# EAGLE board BT60-Test-jig (EAGLE 9.6.2), part 1 of 2
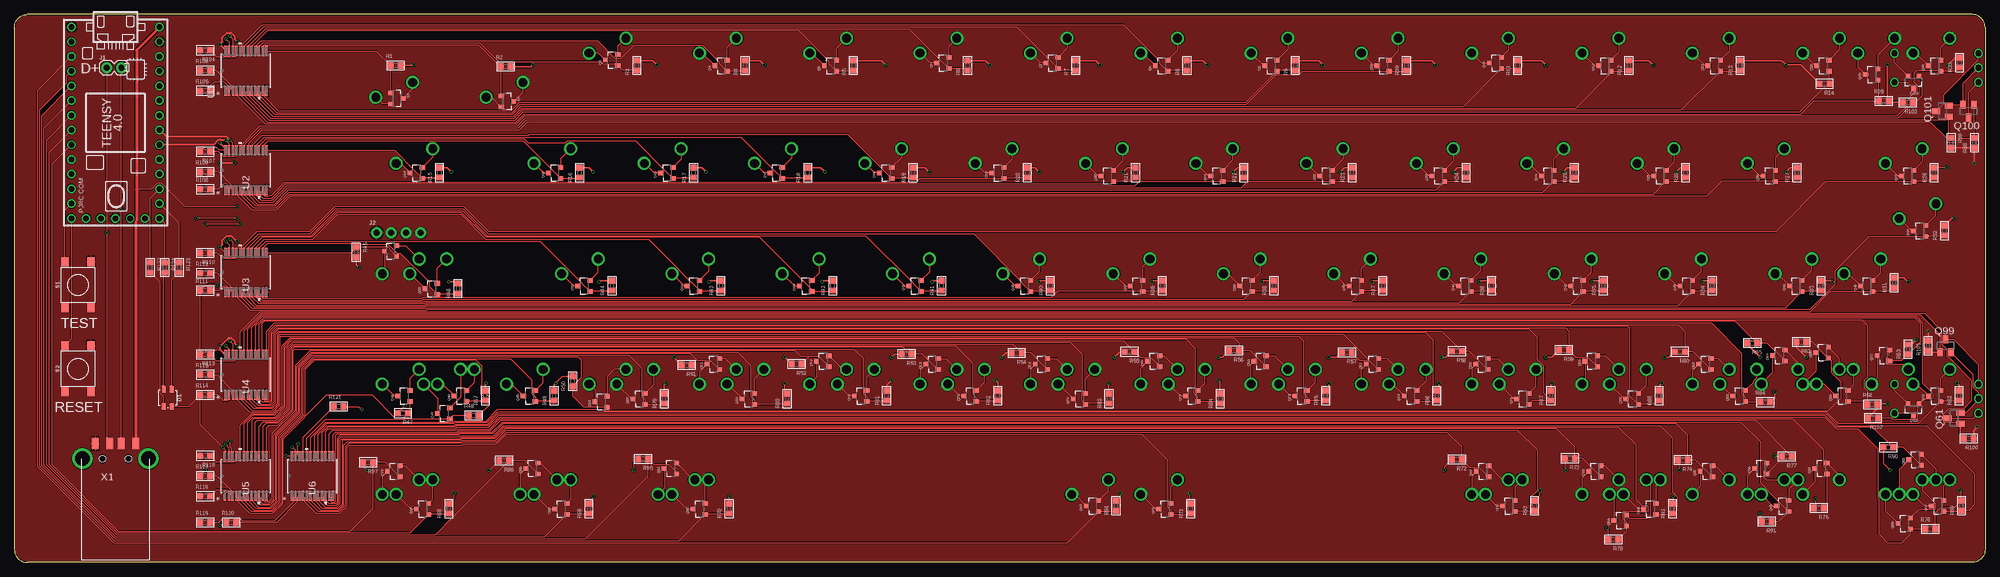
[diagram p2: board, top side]
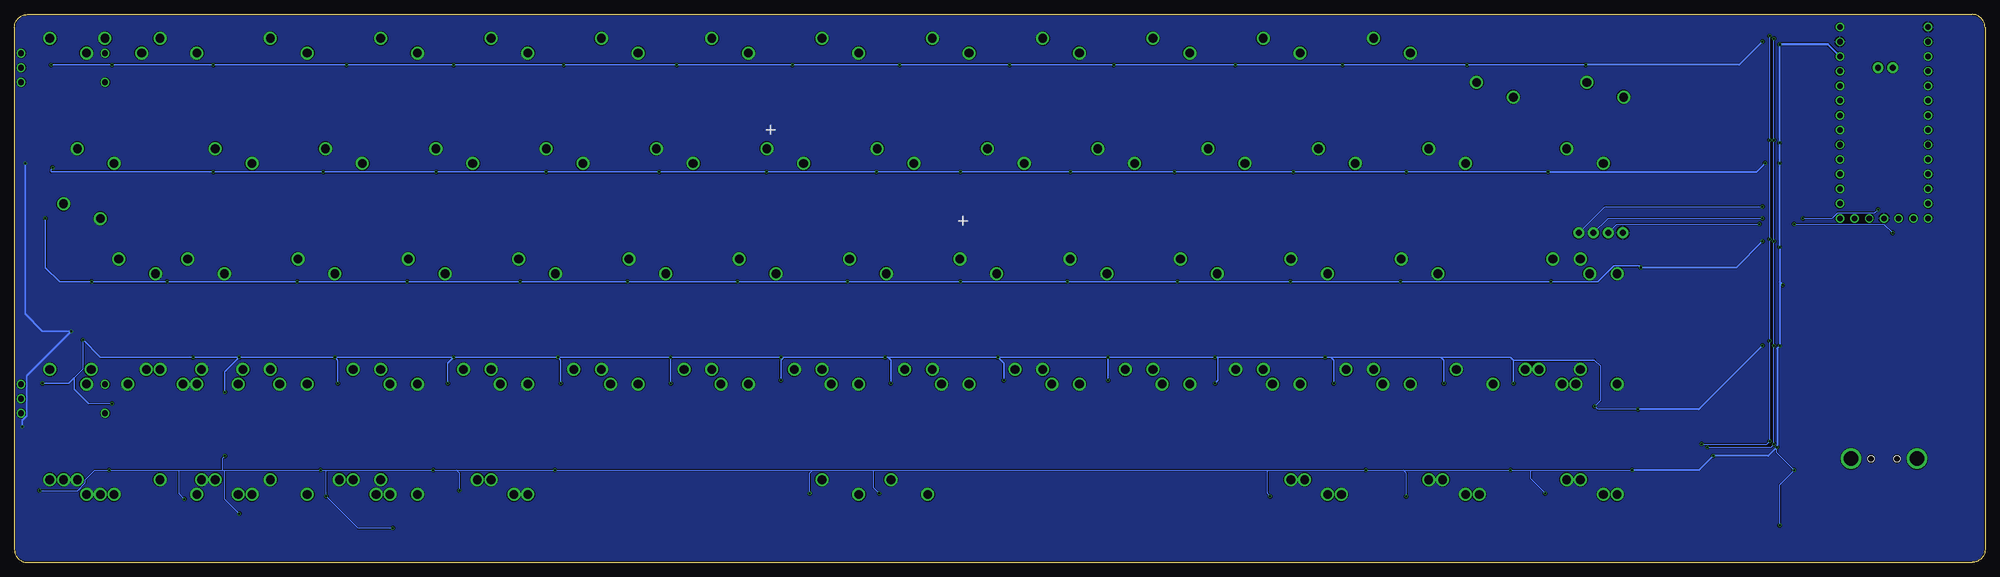
[diagram p3: board, bottom side, seen from below]

Size 340.28 x 94.59 mm. Coordinates in mm from the lower left corner, seen from the top.
Outline: 338.07,94.59 2.21,94.59 arc90 0,92.38 0,2.21 arc90 2.21,0 338.07,0 arc90 340.28,2.21 340.28,92.38 arc90 338.07,94.59
Copper layers (1*16): Top 0.035559375mm / dielectric 1.6mm / Bottom 0.035559375mm
Design rules "jlcpcb2layer": minimum track width 5mil, minimum drill 12mil, track to track 5mil, track to pad 5mil, pad to pad 5mil, via to via 5mil, smd to smd 5mil, copper to edge 8mil, drill to drill 6mil, minimum pad ring 5mil, minimum via ring 3mil, stop-mask expansion 2.5mil, vias tented up to drill 0mil, thermal gap 10mil

## Footprints (pad centres in the part's own frame; a part is rotated, then mirrored left to right if it is on the bottom)
CHERRY-TEST = drill 1.499: P$1 -3.81,2.54; P$2 2.54,5.08
LED-TRICOLOR-SMD = smd 1.2 x 0.7: A 1.5,0.7; B -1.5,0.7; G -1.5,-0.7; R 1.5,-0.7
1X02 = drill 1.016 pad 1.88: 1 0,0; 2 2.54,0
1X04_NO_SILK = drill 1.016 pad 1.88: 1 0,0; 2 2.54,0; 3 5.08,0; 4 7.62,0
SOT23-3 = smd 0.8 x 0.9: 1 -0.95,-1; 2 0.95,-1; 3 0,1.1
SOT23 = smd 1 x 1.4: 1 -0.95,-1.1; 2 0.95,-1.1; 3 0,1.1
0603-R = smd 1 x 1.1: 1 -0.85,0; 2 0.85,0
TACTILE_SWITCH_SMD_6.2MM_TALL = smd 1.55 x 1.3: A1 -3.975,-2.25; A2 3.975,-2.25; B1 -3.975,2.25; B2 3.975,2.25
SOT340-1_NXP = smd 1.753 x 0.432: 1 -3.429,3.575; 2 -3.429,2.925; 3 -3.429,2.275; 4 -3.429,1.625; 5 -3.429,0.975; 6 -3.429,0.325; 7 -3.429,-0.325; 8 -3.429,-0.975; 9 -3.429,-1.625; 10 -3.429,-2.275; 11 -3.429,-2.925; 12 -3.429,-3.575; 13 3.429,-3.575; 14 3.429,-2.925; 15 3.429,-2.275; 16 3.429,-1.625; 17 3.429,-0.975; 18 3.429,-0.325; 19 3.429,0.325; 20 3.429,0.975; 21 3.429,1.625; 22 3.429,2.275; 23 3.429,2.925; 24 3.429,3.575
ENCODER = drill 0.991: A -2.5,-7.5; B 2.5,-7.5; GND 0,-7.5; S1 -2.5,7; S2 2.5,7
TEENSY_4.0 = drill 0.965: 0/RX -13.97,-7.62; 1/TX -11.43,-7.62; 2 -8.89,-7.62; 3/CANTX -6.35,-7.62; 3V3_LN 16.51,-2.54; 3V3_LO -11.43,7.62; 4/CANRX -3.81,-7.62; 5 -1.27,-7.62; 6 1.27,-7.62; 7 3.81,-7.62; 8 6.35,-7.62; 9/CS 8.89,-7.62; 10/CS 11.43,-7.62; 11/MOSI 13.97,-7.62; 12/MISO 16.51,-7.62; 13/SCK 16.51,7.62; 14/A0 13.97,7.62; 15/A1 11.43,7.62; 16/A2 8.89,7.62; 17/A3 6.35,7.62; 18/A4/SDA 3.81,7.62; 19/A5/SCL 1.27,7.62; 20/A6 -1.27,7.62; 21/A7 -3.81,7.62; 22/A8 -6.35,7.62; 23/A9 -8.89,7.62; GND -16.51,-7.62; GND2 -13.97,7.62; GND3 16.51,0; ON/OFF 16.51,5.08; PROG 16.51,2.54; VBAT\ 16.51,-5.08; VIN -16.51,7.62
MOLEX_480371000 = smd 1.2 x 2: 1 3.5,2.6; 2 1,2.6; 3 -1,2.6; 4 -3.5,2.6 | drill 2.5: M1 -5.7,0; M2 5.7,0 | hole 1.1: -2.25,0; 2.25,0

## Placement (x,y rotation side)
0  CHERRY-SOLDERCHERRY-TEST  [CHERRY-TEST]  255.45,85.39 0 top
1  CHERRY-SOLDERCHERRY-TEST  [CHERRY-TEST]  84,85.39 180 top
1U_1  CHERRY-SOLDERCHERRY-TEST  [CHERRY-TEST]  255.45,9.19 0 top
1U_2  CHERRY-SOLDERCHERRY-TEST  [CHERRY-TEST]  274.5,9.19 0 top
1U_3  CHERRY-SOLDERCHERRY-TEST  [CHERRY-TEST]  293.55,9.19 0 top
1U_4  CHERRY-SOLDERCHERRY-TEST  [CHERRY-TEST]  312.6,9.19 0 top
1U_5  CHERRY-SOLDERCHERRY-TEST  [CHERRY-TEST]  331.65,9.19 0 top
2  CHERRY-SOLDERCHERRY-TEST  [CHERRY-TEST]  103.05,85.39 0 top
3  CHERRY-SOLDERCHERRY-TEST  [CHERRY-TEST]  122.1,85.39 0 top
4  CHERRY-SOLDERCHERRY-TEST  [CHERRY-TEST]  141.15,85.39 0 top
5  CHERRY-SOLDERCHERRY-TEST  [CHERRY-TEST]  160.2,85.39 0 top
6  CHERRY-SOLDERCHERRY-TEST  [CHERRY-TEST]  179.25,85.39 0 top
7  CHERRY-SOLDERCHERRY-TEST  [CHERRY-TEST]  198.3,85.39 0 top
8  CHERRY-SOLDERCHERRY-TEST  [CHERRY-TEST]  217.35,85.39 0 top
9  CHERRY-SOLDERCHERRY-TEST  [CHERRY-TEST]  236.4,85.39 0 top
#_ISO  CHERRY-SOLDERCHERRY-TEST  [CHERRY-TEST]  88.76,28.24 0 top
'  CHERRY-SOLDERCHERRY-TEST  [CHERRY-TEST]  288.78,47.29 0 top
,  CHERRY-SOLDERCHERRY-TEST  [CHERRY-TEST]  241.16,28.24 0 top
,_1  CHERRY-SOLDERCHERRY-TEST  [CHERRY-TEST]  236.4,28.24 0 top
-  CHERRY-SOLDERCHERRY-TEST  [CHERRY-TEST]  274.5,85.39 0 top
.  CHERRY-SOLDERCHERRY-TEST  [CHERRY-TEST]  260.21,28.24 0 top
._1  CHERRY-SOLDERCHERRY-TEST  [CHERRY-TEST]  255.45,28.24 0 top
/  CHERRY-SOLDERCHERRY-TEST  [CHERRY-TEST]  279.26,28.24 0 top
/_1  CHERRY-SOLDERCHERRY-TEST  [CHERRY-TEST]  274.5,28.24 0 top
=  CHERRY-SOLDERCHERRY-TEST  [CHERRY-TEST]  293.55,85.39 0 top
[  CHERRY-SOLDERCHERRY-TEST  [CHERRY-TEST]  284.02,66.34 0 top
\  CHERRY-SOLDERCHERRY-TEST  [CHERRY-TEST]  326.88,66.34 0 top
]  CHERRY-SOLDERCHERRY-TEST  [CHERRY-TEST]  303.07,66.34 0 top
A  CHERRY-SOLDERCHERRY-TEST  [CHERRY-TEST]  98.28,47.29 0 top
B  CHERRY-SOLDERCHERRY-TEST  [CHERRY-TEST]  184.01,28.24 0 top
B_1  CHERRY-SOLDERCHERRY-TEST  [CHERRY-TEST]  179.25,28.24 0 top
BS  CHERRY-SOLDERCHERRY-TEST  [CHERRY-TEST]  322.12,85.39 0 top
C  CHERRY-SOLDERCHERRY-TEST  [CHERRY-TEST]  145.91,28.24 0 top
C_1  CHERRY-SOLDERCHERRY-TEST  [CHERRY-TEST]  141.15,28.24 0 top
CAPS  CHERRY-SOLDERCHERRY-TEST  [CHERRY-TEST]  72.09,47.29 0 top
CAPS_STEP  CHERRY-SOLDERCHERRY-TEST  [CHERRY-TEST]  67.33,47.29 0 top
COLON  CHERRY-SOLDERCHERRY-TEST  [CHERRY-TEST]  269.73,47.29 0 top
D  CHERRY-SOLDERCHERRY-TEST  [CHERRY-TEST]  136.38,47.29 0 top
D1  [LED-TRICOLOR-SMD]  26.45,28.41 270 top
E  CHERRY-SOLDERCHERRY-TEST  [CHERRY-TEST]  131.62,66.34 0 top
ENTER  CHERRY-SOLDERCHERRY-TEST  [CHERRY-TEST]  319.74,47.29 0 top
ESC  CHERRY-SOLDERCHERRY-TEST  [CHERRY-TEST]  64.95,85.39 180 top
EXTRA_1U_LEFT  CHERRY-SOLDERCHERRY-TEST  [CHERRY-TEST]  298.31,28.24 0 top
F  CHERRY-SOLDERCHERRY-TEST  [CHERRY-TEST]  155.43,47.29 0 top
FN  CHERRY-SOLDERCHERRY-TEST  [CHERRY-TEST]  329.26,9.19 0 top
G  CHERRY-SOLDERCHERRY-TEST  [CHERRY-TEST]  174.48,47.29 0 top
H  CHERRY-SOLDERCHERRY-TEST  [CHERRY-TEST]  193.53,47.29 0 top
I  CHERRY-SOLDERCHERRY-TEST  [CHERRY-TEST]  226.9,66.34 0 top
ISO_#  CHERRY-SOLDERCHERRY-TEST  [CHERRY-TEST]  307.83,47.29 0 top
ISO_ENTER  CHERRY-SOLDERCHERRY-TEST  [CHERRY-TEST]  329.26,56.82 0 top
J  CHERRY-SOLDERCHERRY-TEST  [CHERRY-TEST]  212.58,47.29 0 top
J1  [1X02]  15.95,85.41 0 top
J2  [1X04_NO_SILK]  62.53,56.88 0 top
K  CHERRY-SOLDERCHERRY-TEST  [CHERRY-TEST]  231.63,47.29 0 top
L  CHERRY-SOLDERCHERRY-TEST  [CHERRY-TEST]  250.68,47.29 0 top
L_1.25U_SHIFT  CHERRY-SOLDERCHERRY-TEST  [CHERRY-TEST]  67.33,28.24 0 top
L_2U_SHIFT  CHERRY-SOLDERCHERRY-TEST  [CHERRY-TEST]  74.47,28.24 0 top
L_SHIFT  CHERRY-SOLDERCHERRY-TEST  [CHERRY-TEST]  76.85,28.24 0 top
LALT  CHERRY-SOLDERCHERRY-TEST  [CHERRY-TEST]  114.95,9.19 0 top
LALT_1.5U  CHERRY-SOLDERCHERRY-TEST  [CHERRY-TEST]  117.33,9.19 0 top
LCTRL  CHERRY-SOLDERCHERRY-TEST  [CHERRY-TEST]  67.33,9.19 0 top
LCTRL_1.5U  CHERRY-SOLDERCHERRY-TEST  [CHERRY-TEST]  69.71,9.19 0 top
LWIN  CHERRY-SOLDERCHERRY-TEST  [CHERRY-TEST]  91.14,9.19 0 top
LWIN_1U  CHERRY-SOLDERCHERRY-TEST  [CHERRY-TEST]  93.52,9.19 0 top
M  CHERRY-SOLDERCHERRY-TEST  [CHERRY-TEST]  222.11,28.24 0 top
M_1  CHERRY-SOLDERCHERRY-TEST  [CHERRY-TEST]  217.35,28.24 0 top
MENU  CHERRY-SOLDERCHERRY-TEST  [CHERRY-TEST]  281.64,9.19 0 top
MENU_1U  CHERRY-SOLDERCHERRY-TEST  [CHERRY-TEST]  303.07,9.19 0 top
N  CHERRY-SOLDERCHERRY-TEST  [CHERRY-TEST]  203.06,28.24 0 top
N_1  CHERRY-SOLDERCHERRY-TEST  [CHERRY-TEST]  198.3,28.24 0 top
O  CHERRY-SOLDERCHERRY-TEST  [CHERRY-TEST]  245.92,66.34 0 top
P  CHERRY-SOLDERCHERRY-TEST  [CHERRY-TEST]  264.97,66.34 0 top
Q  CHERRY-SOLDERCHERRY-TEST  [CHERRY-TEST]  93.52,66.34 0 top
Q1  MOSFET-PCHANNEL  [SOT23-3]  66.01,80.1 270 top
Q2  MOSFET-PCHANNEL  [SOT23-3]  85.08,79.56 270 top
Q3  MOSFET-PCHANNEL  [SOT23-3]  103.2,86.73 90 top
Q4  MOSFET-PCHANNEL  [SOT23-3]  122.08,85.73 90 top
Q5  MOSFET-PCHANNEL  [SOT23-3]  140.97,85.73 90 top
Q6  MOSFET-PCHANNEL  [SOT23-3]  160.36,86.23 90 top
Q7  MOSFET-PCHANNEL  [SOT23-3]  179.24,86.23 90 top
Q8  MOSFET-PCHANNEL  [SOT23-3]  198.13,85.73 90 top
Q9  MOSFET-PCHANNEL  [SOT23-3]  217.02,85.73 90 top
Q10  MOSFET-PCHANNEL  [SOT23-3]  236.4,85.73 90 top
Q11  MOSFET-PCHANNEL  [SOT23-3]  255.79,86.23 90 top
Q12  MOSFET-PCHANNEL  [SOT23-3]  274.67,85.73 90 top
Q13  MOSFET-PCHANNEL  [SOT23-3]  293.56,85.73 90 top
Q14  MOSFET-PCHANNEL  [SOT23-3]  69.45,67.23 90 top
Q15  MOSFET-PCHANNEL  [SOT23-3]  93.33,67.23 90 top
Q16  MOSFET-PCHANNEL  [SOT23-3]  112.72,67.23 90 top
Q17  MOSFET-PCHANNEL  [SOT23-3]  131.6,67.23 90 top
Q18  MOSFET-PCHANNEL  [SOT23-3]  150.49,67.23 90 top
Q19  MOSFET-PCHANNEL  [SOT23-3]  169.88,67.23 90 top
Q20  MOSFET-PCHANNEL  [SOT23-3]  188.76,66.73 90 top
Q21  MOSFET-PCHANNEL  [SOT23-3]  207.65,66.73 90 top
Q22  MOSFET-PCHANNEL  [SOT23-3]  226.54,66.73 90 top
Q23  MOSFET-PCHANNEL  [SOT23-3]  245.92,66.73 90 top
Q24  MOSFET-PCHANNEL  [SOT23-3]  264.81,66.73 90 top
Q25  MOSFET-PCHANNEL  [SOT23-3]  284.19,66.73 90 top
Q26  MOSFET-PCHANNEL  [SOT23-3]  303.08,66.73 90 top
Q27  MOSFET-PCHANNEL  [SOT23-3]  326.97,66.73 90 top
Q28  MOSFET-PCHANNEL  [SOT23-3]  312.35,85.73 90 top
Q29  MOSFET-PCHANNEL  [SOT23-3]  320.74,84.23 90 top
Q30  MOSFET-PCHANNEL  [SOT23-3]  331.63,85.73 90 top
Q31  MOSFET-PCHANNEL  [SOT23-3]  65.01,53.73 90 top
Q32  MOSFET-PCHANNEL  [SOT23-3]  98.4,47.73 90 top
Q33  MOSFET-PCHANNEL  [SOT23-3]  117.28,47.73 90 top
Q34  MOSFET-PCHANNEL  [SOT23-3]  136.67,47.73 90 top
Q35  MOSFET-PCHANNEL  [SOT23-3]  155.56,47.73 90 top
Q36  MOSFET-PCHANNEL  [SOT23-3]  174.44,47.73 90 top
Q37  MOSFET-PCHANNEL  [SOT23-3]  193.83,47.73 90 top
Q38  MOSFET-PCHANNEL  [SOT23-3]  212.72,47.73 90 top
Q39  MOSFET-PCHANNEL  [SOT23-3]  231.6,47.73 90 top
Q40  MOSFET-PCHANNEL  [SOT23-3]  250.49,47.73 90 top
Q41  MOSFET-PCHANNEL  [SOT23-3]  269.87,47.73 90 top
Q42  MOSFET-PCHANNEL  [SOT23-3]  288.76,47.73 90 top
Q43  MOSFET-PCHANNEL  [SOT23-3]  307.65,47.73 90 top
Q44  MOSFET-PCHANNEL  [SOT23-3]  329.03,57.23 90 top
Q45  MOSFET-PCHANNEL  [SOT23-3]  319.92,47.73 90 top
Q46  MOSFET-PCHANNEL  [SOT23-3]  67.3,28.73 90 top
Q47  MOSFET-PCHANNEL  [SOT23-3]  74.19,25.73 90 top
Q48  MOSFET-PCHANNEL  [SOT23-3]  77.08,28.73 90 top
Q49  MOSFET-PCHANNEL  [SOT23-3]  88.96,28.73 90 top
Q50  MOSFET-PCHANNEL  [SOT23-3]  101.35,27.73 90 top
Q51  MOSFET-PCHANNEL  [SOT23-3]  120.74,34.23 90 top
Q52  MOSFET-PCHANNEL  [SOT23-3]  139.62,34.73 90 top
Q53  MOSFET-PCHANNEL  [SOT23-3]  158.51,34.23 90 top
Q54  MOSFET-PCHANNEL  [SOT23-3]  177.39,34.23 90 top
Q55  MOSFET-PCHANNEL  [SOT23-3]  196.78,34.73 90 top
Q56  MOSFET-PCHANNEL  [SOT23-3]  215.17,34.73 90 top
Q57  MOSFET-PCHANNEL  [SOT23-3]  234.55,34.23 90 top
Q58  MOSFET-PCHANNEL  [SOT23-3]  253.44,34.23 90 top
Q59  MOSFET-PCHANNEL  [SOT23-3]  272.33,34.73 90 top
Q60  MOSFET-PCHANNEL  [SOT23-3]  312.21,36.23 90 top
Q61  [SOT23]  334.95,24.91 90 top
Q62  MOSFET-PCHANNEL  [SOT23-3]  291.98,34.23 90 top
Q63  MOSFET-PCHANNEL  [SOT23-3]  297.87,28.73 90 top
Q64  MOSFET-PCHANNEL  [SOT23-3]  304.76,35.73 90 top
Q65  MOSFET-PCHANNEL  [SOT23-3]  315.64,28.73 90 top
Q66  MOSFET-PCHANNEL  [SOT23-3]  72.03,47.23 90 top
Q67  MOSFET-PCHANNEL  [SOT23-3]  107.91,28.23 90 top
Q68  MOSFET-PCHANNEL  [SOT23-3]  126.8,28.23 90 top
Q69  MOSFET-PCHANNEL  [SOT23-3]  146.19,28.73 90 top
Q70  MOSFET-PCHANNEL  [SOT23-3]  165.07,28.73 90 top
Q71  MOSFET-PCHANNEL  [SOT23-3]  183.96,28.23 90 top
Q72  MOSFET-PCHANNEL  [SOT23-3]  203.35,28.73 90 top
Q73  MOSFET-PCHANNEL  [SOT23-3]  222.23,28.73 90 top
Q74  MOSFET-PCHANNEL  [SOT23-3]  241.12,28.73 90 top
Q75  MOSFET-PCHANNEL  [SOT23-3]  260.5,28.23 90 top
Q76  MOSFET-PCHANNEL  [SOT23-3]  279.39,28.23 90 top
Q77  MOSFET-PCHANNEL  [SOT23-3]  322.78,35.73 90 top
Q78  MOSFET-PCHANNEL  [SOT23-3]  331.66,28.73 90 top
Q79  MOSFET-PCHANNEL  [SOT23-3]  65.55,15.73 90 top
Q80  MOSFET-PCHANNEL  [SOT23-3]  89.44,16.23 90 top
Q81  MOSFET-PCHANNEL  [SOT23-3]  113.32,16.23 90 top
Q82  MOSFET-PCHANNEL  [SOT23-3]  186.21,9.73 90 top
Q83  MOSFET-PCHANNEL  [SOT23-3]  258.09,9.73 90 top
Q84  MOSFET-PCHANNEL  [SOT23-3]  282.48,9.23 90 top
Q85  MOSFET-PCHANNEL  [SOT23-3]  305.37,9.73 90 top
Q86  MOSFET-PCHANNEL  [SOT23-3]  328.25,17.73 90 top
Q87  MOSFET-PCHANNEL  [SOT23-3]  332.14,9.73 90 top
Q88  MOSFET-PCHANNEL  [SOT23-3]  70.53,9.23 90 top
Q89  MOSFET-PCHANNEL  [SOT23-3]  94.41,9.23 90 top
Q90  MOSFET-PCHANNEL  [SOT23-3]  118.3,9.23 90 top
Q91  MOSFET-PCHANNEL  [SOT23-3]  198.68,9.23 90 top
Q92  MOSFET-PCHANNEL  [SOT23-3]  253.57,15.73 90 top
Q93  MOSFET-PCHANNEL  [SOT23-3]  272.96,15.73 90 top
Q94  MOSFET-PCHANNEL  [SOT23-3]  277.34,7.23 90 top
Q95  MOSFET-PCHANNEL  [SOT23-3]  292.23,15.73 90 top
Q96  MOSFET-PCHANNEL  [SOT23-3]  301.61,16.23 90 top
Q97  MOSFET-PCHANNEL  [SOT23-3]  312,16.23 90 top
Q98  MOSFET-PCHANNEL  [SOT23-3]  326.39,6.73 90 top
Q99  [SOT23]  333.45,37.41 0 top
Q100  [SOT23]  337.45,77.91 180 top
Q101  [SOT23]  332.95,77.91 90 top
Q102  MOSFET-PCHANNEL  [SOT23-3]  327.95,26.41 180 top
Q103  MOSFET-PCHANNEL  [SOT23-3]  327.95,82.91 180 top
R  CHERRY-SOLDERCHERRY-TEST  [CHERRY-TEST]  150.67,66.34 0 top
R1  100k  [0603-R]  65.82,85.78 0 top
R2  100k  [0603-R]  84.82,85.58 0 top
R3  100k  [0603-R]  107.47,85.78 90 top
R4  100k  [0603-R]  126.17,85.78 90 top
R5  100k  [0603-R]  144.87,85.78 90 top
R6  100k  [0603-R]  164.57,85.78 90 top
R7  100k  [0603-R]  183.27,85.78 90 top
R8  100k  [0603-R]  202.47,85.78 90 top
R9  100k  [0603-R]  221.17,85.78 90 top
R10  100k  [0603-R]  240.37,85.78 90 top
R11  100k  [0603-R]  259.57,85.78 90 top
R12  100k  [0603-R]  278.77,85.78 90 top
R13  100k  [0603-R]  297.97,85.78 90 top
R14  100k  [0603-R]  312.57,82.64 180 top
R15  100k  [0603-R]  73.38,67.28 90 top
R16  100k  [0603-R]  97.58,67.28 90 top
R17  100k  [0603-R]  117.28,67.28 90 top
R18  100k  [0603-R]  136.98,67.28 90 top
R19  100k  [0603-R]  155.18,67.28 90 top
R20  100k  [0603-R]  174.88,67.28 90 top
R21  100k  [0603-R]  193.58,67.28 90 top
R22  100k  [0603-R]  212.28,67.28 90 top
R23  100k  [0603-R]  230.98,67.28 90 top
R24  100k  [0603-R]  250.68,67.28 90 top
R25  100k  [0603-R]  269.38,67.28 90 top
R26  100k  [0603-R]  288.58,67.28 90 top
R27  100k  [0603-R]  307.78,67.28 90 top
R28  100k  [0603-R]  331.48,67.28 90 top
R29  100k  [0603-R]  322.82,79.67 0 top
R30  100k  [0603-R]  335.88,86.28 90 top
R31  100k  [0603-R]  324.58,48.28 90 top
R32  100k  [0603-R]  333.28,57.28 90 top
R33  100k  [0603-R]  311.98,47.78 90 top
R34  100k  [0603-R]  293.18,47.78 90 top
R35  100k  [0603-R]  274.38,47.78 90 top
R36  100k  [0603-R]  255.08,47.78 90 top
R37  100k  [0603-R]  236.28,47.78 90 top
R38  100k  [0603-R]  217.48,47.78 90 top
R39  100k  [0603-R]  198.19,47.78 90 top
R40  100k  [0603-R]  178.89,47.78 90 top
R41  100k  [0603-R]  160.09,47.78 90 top
R42  100k  [0603-R]  141.29,47.78 90 top
R43  100k  [0603-R]  121.99,47.78 90 top
R44  100k  [0603-R]  103.19,47.78 90 top
R45  100k  [0603-R]  59,53.53 270 top
R46  100k  [0603-R]  76.59,47.28 90 top
R47  100k  [0603-R]  67.07,25.75 180 top
R48  100k  [0603-R]  79.32,25.36 0 top
R49  100k  [0603-R]  93.19,28.78 90 top
R50  100k  [0603-R]  96.39,31.28 90 top
R51  100k  [0603-R]  116.07,34.05 180 top
R52  100k  [0603-R]  135.07,34.25 180 top
R53  100k  [0603-R]  154.07,35.95 180 top
R54  100k  [0603-R]  173.07,36.15 180 top
R55  100k  [0603-R]  192.57,36.35 180 top
R56  100k  [0603-R]  210.57,36.55 180 top
R57  100k  [0603-R]  230.07,36.25 180 top
R58  100k  [0603-R]  249.07,36.45 180 top
R59  100k  [0603-R]  267.57,36.66 180 top
R60  100k  [0603-R]  287.57,36.36 180 top
R61  100k  [0603-R]  308.57,38.06 180 top
R62  100k  [0603-R]  335.79,28.78 90 top
R63  100k  [0603-R]  326.99,36.78 90 top
R64  100k  [0603-R]  302.32,27.66 0 top
R65  100k  [0603-R]  300.07,37.86 180 top
R66  100k  [0603-R]  320.82,27.26 0 top
R67  100k  [0603-R]  81.3,28.78 90 top
R68  100k  [0603-R]  75,9.28 90 top
R69  100k  [0603-R]  99.2,9.28 90 top
R70  100k  [0603-R]  123.4,9.28 90 top
R71  100k  [0603-R]  203.1,9.28 90 top
R72  100k  [0603-R]  249.07,17.76 180 top
R73  100k  [0603-R]  268.57,17.96 180 top
R74  100k  [0603-R]  288.07,17.66 180 top
R75  100k  [0603-R]  311.57,9.36 180 top
R76  100k  [0603-R]  330.82,5.75 0 top
R77  100k  [0603-R]  306.07,18.26 180 top
R78  100k  [0603-R]  276.07,3.96 180 top
R79  100k  [0603-R]  112.2,28.28 90 top
R80  100k  [0603-R]  133.4,28.28 90 top
R81  100k  [0603-R]  150.6,28.78 90 top
R82  100k  [0603-R]  169.8,28.78 90 top
R83  100k  [0603-R]  189,28.28 90 top
R84  100k  [0603-R]  208.2,28.28 90 top
R85  100k  [0603-R]  226.4,28.78 90 top
R86  100k  [0603-R]  245.6,28.78 90 top
R87  100k  [0603-R]  265.3,28.78 90 top
R88  100k  [0603-R]  284,28.78 90 top
R89  100k  [0603-R]  336.21,9.78 90 top
R90  100k  [0603-R]  323.57,19.87 180 top
R91  100k  [0603-R]  302.57,7.07 180 top
R92  100k  [0603-R]  286.31,9.28 90 top
R93  100k  [0603-R]  262.51,9.78 90 top
R94  100k  [0603-R]  190.21,9.78 90 top
R95  100k  [0603-R]  108.57,17.87 180 top
R96  100k  [0603-R]  84.57,17.57 180 top
R97  100k  [0603-R]  61.07,17.27 180 top
R98  100k  [0603-R]  338.45,72.41 90 top
R99  100k  [0603-R]  334.45,72.41 270 top
R100  100k  [0603-R]  337.45,21.41 180 top
R101  100k  [0603-R]  330.45,37.41 90 top
R102  100k  [0603-R]  320.95,24.91 180 top
R103  100k  [0603-R]  326.95,79.41 180 top
R104  100k  [0603-R]  32.95,88.41 180 top
R105  100k  [0603-R]  32.95,81.41 0 top
R106  100k  [0603-R]  32.95,84.91 0 top
R107  100k  [0603-R]  32.95,70.91 180 top
R108  100k  [0603-R]  32.95,64.41 0 top
R109  100k  [0603-R]  32.95,67.41 0 top
R110  100k  [0603-R]  32.95,53.41 180 top
R111  100k  [0603-R]  32.95,46.91 0 top
R112  100k  [0603-R]  32.95,49.91 0 top
R113  100k  [0603-R]  32.95,35.91 180 top
R114  100k  [0603-R]  32.95,28.91 0 top
R115  100k  [0603-R]  32.95,32.41 0 top
R116  100k  [0603-R]  32.95,11.41 0 top
R117  100k  [0603-R]  32.95,14.91 0 top
R118  100k  [0603-R]  32.95,18.41 180 top
R119  100k  [0603-R]  32.95,6.91 0 top
R120  100k  [0603-R]  37.45,6.91 0 top
R121  100k  [0603-R]  55.95,26.91 0 top
R122  200  [0603-R]  23.45,50.91 270 top
R123  200  [0603-R]  28.45,50.91 270 top
R124  200  [0603-R]  25.95,50.91 270 top
R_ALT_1.5  CHERRY-SOLDERCHERRY-TEST  [CHERRY-TEST]  279.26,9.19 0 top
R_CTRL_1.5U  CHERRY-SOLDERCHERRY-TEST  [CHERRY-TEST]  326.88,9.19 0 top
R_SHIFT  CHERRY-SOLDERCHERRY-TEST  [CHERRY-TEST]  314.98,28.24 0 top
R_SHIFT_1.75U_LEFT  CHERRY-SOLDERCHERRY-TEST  [CHERRY-TEST]  305.45,28.24 0 top
R_SHIFT_1.75U_RIGHT  CHERRY-SOLDERCHERRY-TEST  [CHERRY-TEST]  324.5,28.24 0 top
RALT  CHERRY-SOLDERCHERRY-TEST  [CHERRY-TEST]  257.83,9.19 0 top
RCTRL  CHERRY-SOLDERCHERRY-TEST  [CHERRY-TEST]  305.45,9.19 0 top
S  CHERRY-SOLDERCHERRY-TEST  [CHERRY-TEST]  117.33,47.29 0 top
S1  MOMENTARY-SWITCH-SPST-SMD-6.2MM-TALL  [TACTILE_SWITCH_SMD_6.2MM_TALL]  10.95,47.91 90 top
S2  MOMENTARY-SWITCH-SPST-SMD-6.2MM-TALL  [TACTILE_SWITCH_SMD_6.2MM_TALL]  10.95,33.41 90 top
SPACE_6.25U  CHERRY-SOLDERCHERRY-TEST  [CHERRY-TEST]  186.39,9.19 0 top
SPACE_7U  CHERRY-SOLDERCHERRY-TEST  [CHERRY-TEST]  198.3,9.19 0 top
SPLIT_BS_1  CHERRY-SOLDERCHERRY-TEST  [CHERRY-TEST]  312.6,85.39 0 top
SPLIT_BS_2  CHERRY-SOLDERCHERRY-TEST  [CHERRY-TEST]  331.65,85.39 0 top
T  CHERRY-SOLDERCHERRY-TEST  [CHERRY-TEST]  169.72,66.34 0 top
TAB  CHERRY-SOLDERCHERRY-TEST  [CHERRY-TEST]  69.71,66.34 0 top
U  CHERRY-SOLDERCHERRY-TEST  [CHERRY-TEST]  207.82,66.34 0 top
U1  PCF8575TS/1  [SOT340-1_NXP]  39.97,84.85 90 top
U2  PCF8575TS/1  [SOT340-1_NXP]  39.97,67.7 90 top
U3  PCF8575TS/1  [SOT340-1_NXP]  39.97,50.05 90 top
U4  PCF8575TS/1  [SOT340-1_NXP]  39.97,32.4 90 top
U5  PCF8575TS/1  [SOT340-1_NXP]  39.95,14.91 90 top
U6  PCF8575TS/1  [SOT340-1_NXP]  51.45,14.91 90 top
U$1  ENCODER  [ENCODER]  331.65,85.39 90 top
U$2  TEENSY_4.0  [TEENSY_4.0]  17.45,75.91 270 top
U$3  ENCODER  [ENCODER]  331.65,28.24 90 top
UP  CHERRY-SOLDERCHERRY-TEST  [CHERRY-TEST]  293.55,28.24 0 top
V  CHERRY-SOLDERCHERRY-TEST  [CHERRY-TEST]  164.96,28.24 0 top
V_1  CHERRY-SOLDERCHERRY-TEST  [CHERRY-TEST]  160.2,28.24 0 top
W  CHERRY-SOLDERCHERRY-TEST  [CHERRY-TEST]  112.57,66.34 0 top
X  CHERRY-SOLDERCHERRY-TEST  [CHERRY-TEST]  126.86,28.24 0 top
X1  USB-A  [MOLEX_480371000]  17.45,17.91 0 top
X5U_1  CHERRY-SOLDERCHERRY-TEST  [CHERRY-TEST]  312.6,28.24 0 top
X5U_2  CHERRY-SOLDERCHERRY-TEST  [CHERRY-TEST]  331.65,28.24 0 top
X_1  CHERRY-SOLDERCHERRY-TEST  [CHERRY-TEST]  122.1,28.24 0 top
Y  CHERRY-SOLDERCHERRY-TEST  [CHERRY-TEST]  188.77,66.34 0 top
Z  CHERRY-SOLDERCHERRY-TEST  [CHERRY-TEST]  107.81,28.24 0 top
Z_1  CHERRY-SOLDERCHERRY-TEST  [CHERRY-TEST]  103.05,28.24 0 top